# EAGLE schematic IotaWatt4.1 (EAGLE 8.1.1)
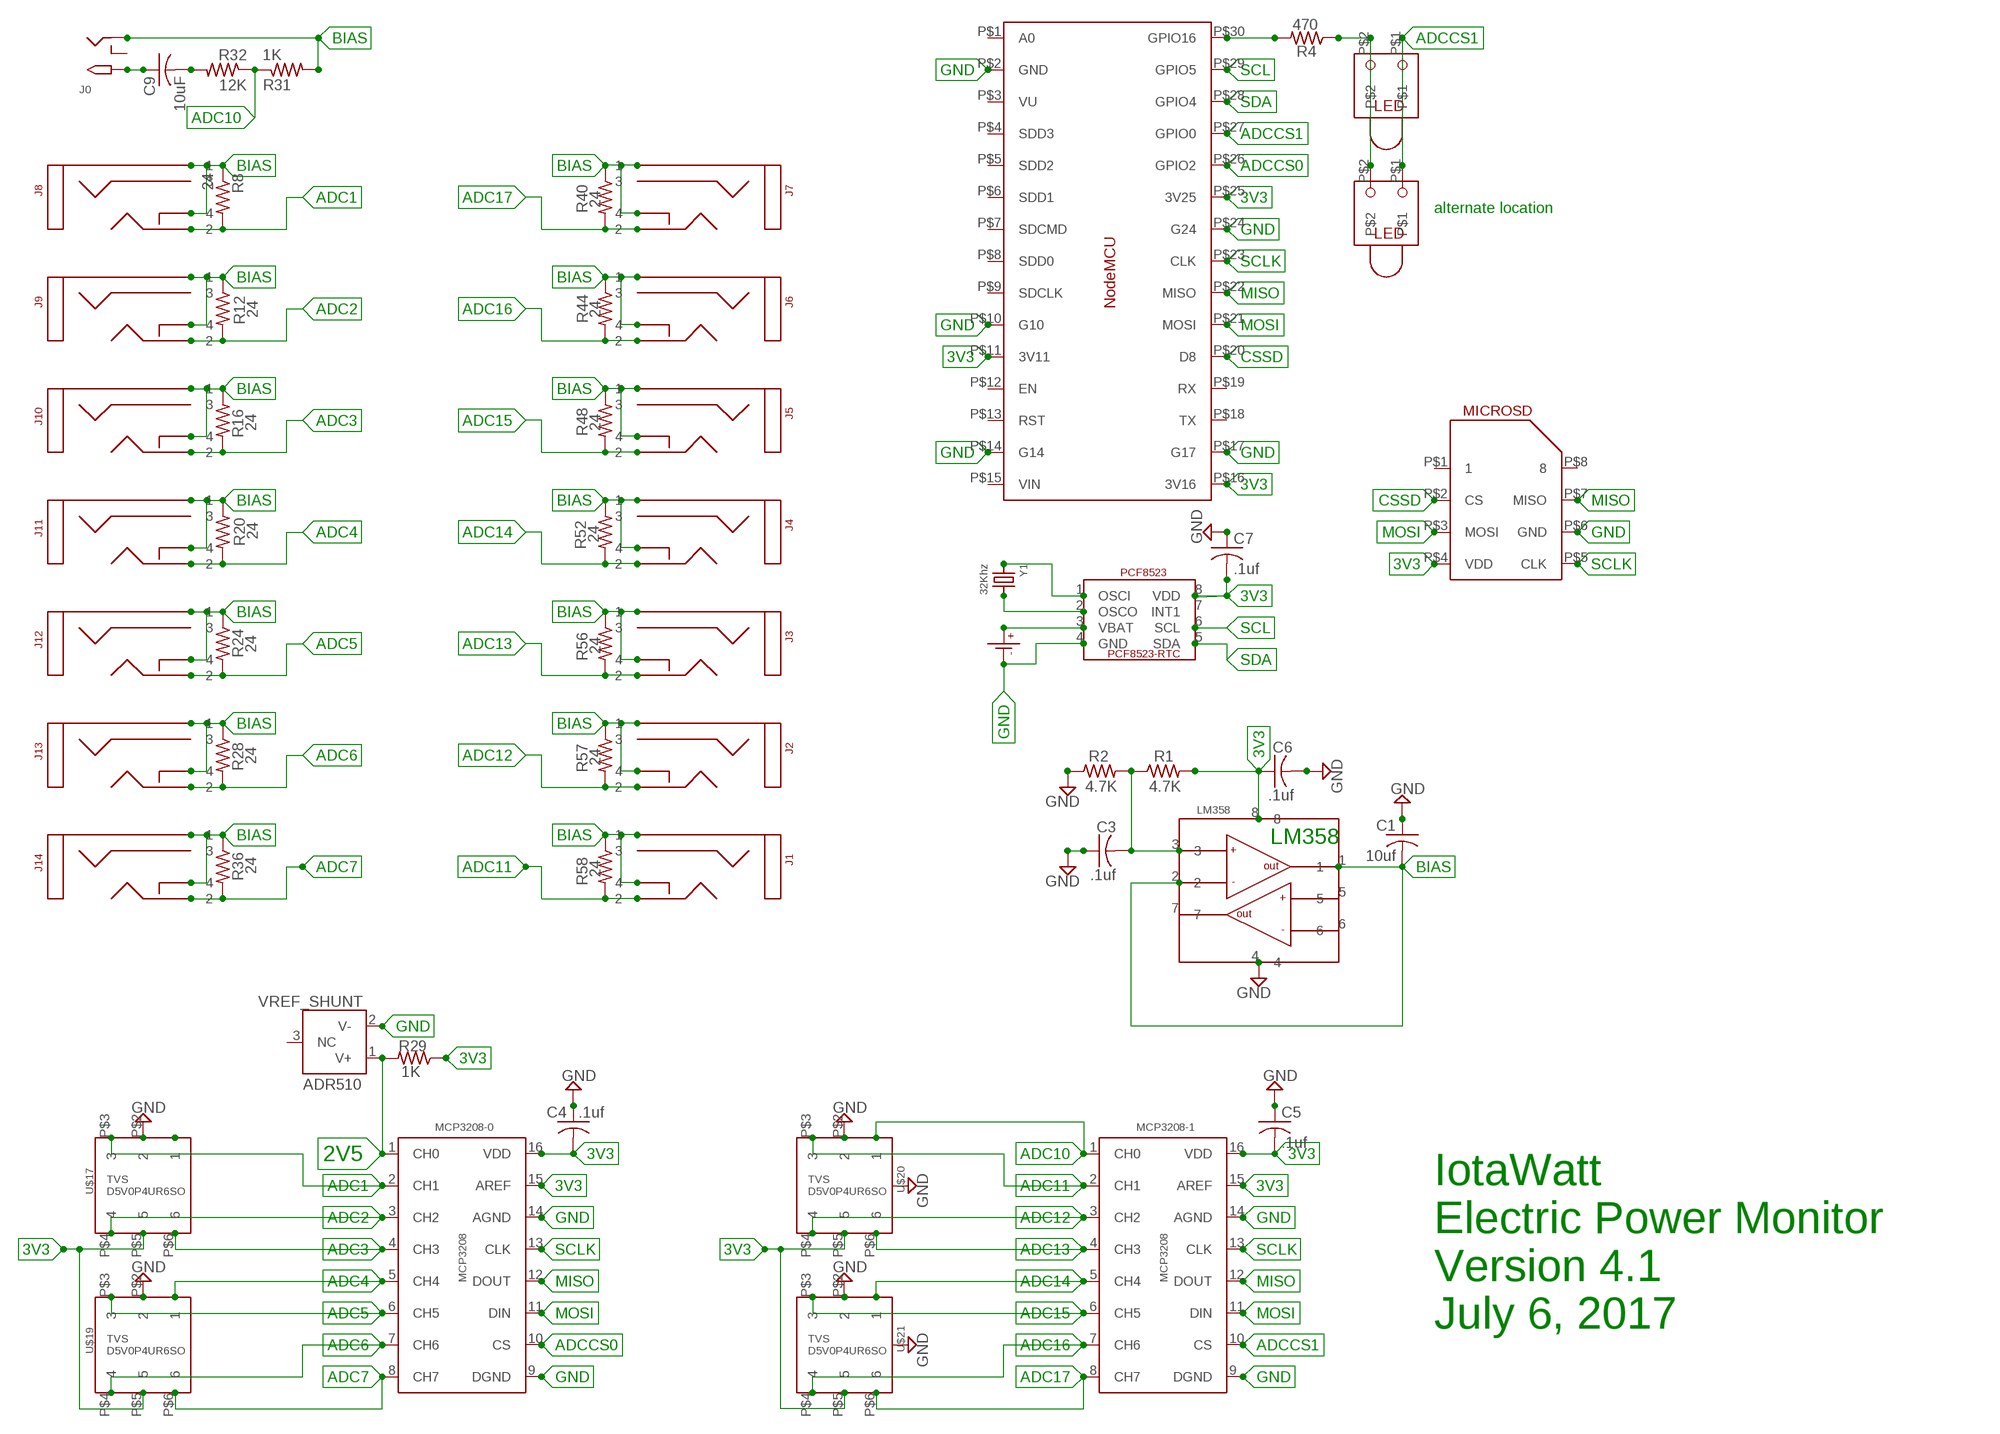
[diagram p0: schematic, sheet 1]

## Parts
ADR510  VREF_SHUNT  [SOT23_3]
C1  10uf  C-USC0805  [C0805]
C3  .1uf  C-USC0805  [C0805]
C4  .1uf  C-USC0402  [C0402]
C5  .1uf  C-USC0402  [C0402]
C6  .1uf  C-USC0402  [C0402]
C7  .1uf  C-USC0402  [C0402]
C9  10uF  C-USC0805  [C0805]
J0  2.1MMJACKSMT  [DCJACK_2MM_SMT]
J1  STEREO_SMD  [STEREO_SMT]
J2  STEREO_SMD  [STEREO_SMT]
J3  STEREO_SMD  [STEREO_SMT]
J4  STEREO_SMD  [STEREO_SMT]
J5  STEREO_SMD  [STEREO_SMT]
J6  STEREO_SMD  [STEREO_SMT]
J7  STEREO_SMD  [STEREO_SMT]
J8  STEREO_SMD  [STEREO_SMT]
J9  STEREO_SMD  [STEREO_SMT]
J10  STEREO_SMD  [STEREO_SMT]
J11  STEREO_SMD  [STEREO_SMT]
J12  STEREO_SMD  [STEREO_SMT]
J13  STEREO_SMD  [STEREO_SMT]
J14  STEREO_SMD  [STEREO_SMT]
MCP3208-0  MCP3208  [SOIC_16]
MCP3208-1  MCP3208  [SOIC_16]
MICROSD  MICROSD_PUSH/PULL  [MICROSD]
PCF8523  PCF8523_RTC  [SOIC_8]
R1  4.7K  R-US_R0805  [R0805]
R2  4.7K  R-US_R0805  [R0805]
R4  470  R-US_R0805  [R0805]
R8  24  R-US_R0805  [R0805]
R12  24  R-US_R0805  [R0805]
R16  24  R-US_R0805  [R0805]
R20  24  R-US_R0805  [R0805]
R24  24  R-US_R0805  [R0805]
R28  24  R-US_R0805  [R0805]
R29  1K  R-US_R0805  [R0805]
R31  1K  R-US_R0805  [R0805]
R32  12K  R-US_R0805  [R0805]
R36  24  R-US_R0805  [R0805]
R40  24  R-US_R0805  [R0805]
R44  24  R-US_R0805  [R0805]
R48  24  R-US_R0805  [R0805]
R52  24  R-US_R0805  [R0805]
R56  24  R-US_R0805  [R0805]
R57  24  R-US_R0805  [R0805]
R58  24  R-US_R0805  [R0805]
U$15  LED_RT_TRH  [LED_TH_RT]
U$16  NODEMCU  [NODEMCU]
U$17  TVS_4CHAN_ARRAY  [SC-74]
U$18  CR1220SMD  [CR1220SMD]
U$19  TVS_4CHAN_ARRAY  [SC-74]
U$20  TVS_4CHAN_ARRAY  [SC-74]
U$21  TVS_4CHAN_ARRAY  [SC-74]
U$22  LM358_DUAL_OP-AMP  [SOIC_8]
U$23  LED_RT_TRH  [LED_TH_RT]
Y1  32Khz  CRYSTAL8X3.8SMT  [CRYSTAL_8X3.8]

## Nets
2V5: ADR510.1(V+) MCP3208-0.1(CH0) R29.2
3V3: C4.2 C5.2 C6.1 C7.2 MCP3208-0.15(AREF) MCP3208-0.16(VDD) MCP3208-1.15(AREF) MCP3208-1.16(VDD) MICROSD.P$4(VDD) PCF8523.8(VDD) R1.2 R29.1 U$16.P$11(3V11) U$16.P$16(3V16) U$16.P$25(3V25) U$17.P$5 U$19.P$5 U$20.P$5 U$21.P$5 U$22.8
ADC1: J8.P$2 MCP3208-0.2(CH1) R8.2 U$17.P$3
ADC2: J9.P$2 MCP3208-0.3(CH2) R12.2 U$17.P$4
ADC3: J10.P$2 MCP3208-0.4(CH3) R16.2 U$17.P$6
ADC4: J11.P$2 MCP3208-0.5(CH4) R20.2 U$19.P$1
ADC5: J12.P$2 MCP3208-0.6(CH5) R24.2 U$19.P$3
ADC6: J13.P$2 MCP3208-0.7(CH6) R28.2 U$19.P$4
ADC7: J14.P$2 MCP3208-0.8(CH7) R36.2 U$19.P$6
ADC10: MCP3208-1.1(CH0) R31.1 R32.1 U$20.P$1
ADC11: J1.P$2 MCP3208-1.2(CH1) R58.2 U$20.P$3
ADC12: J2.P$2 MCP3208-1.3(CH2) R57.2 U$20.P$4
ADC13: J3.P$2 MCP3208-1.4(CH3) R56.2 U$20.P$6
ADC14: J4.P$2 MCP3208-1.5(CH4) R52.2 U$21.P$1
ADC15: J5.P$2 MCP3208-1.6(CH5) R48.2 U$21.P$3
ADC16: J6.P$2 MCP3208-1.7(CH6) R44.2 U$21.P$4
ADC17: J7.P$2 MCP3208-1.8(CH7) R40.2 U$21.P$6
ADCCS0: MCP3208-0.10(CS) U$16.P$26(GPIO2)
ADCCS1: MCP3208-1.10(CS) U$15.P$1 U$16.P$27(GPIO0) U$23.P$1
BIAS: C1.2 J0.GND(RING) J1.P$1 J1.P$4 J2.P$1 J2.P$4 J3.P$1 J3.P$4 J4.P$1 J4.P$4 J5.P$1 J5.P$4 J6.P$1 J6.P$4 J7.P$1 J7.P$4 J8.P$1 J8.P$4 J9.P$1 J9.P$4 J10.P$1 J10.P$4 J11.P$1 J11.P$4 J12.P$1 J12.P$4 J13.P$1 J13.P$4 J14.P$1 J14.P$4 R8.1 R12.1 R16.1 R20.1 R24.1 R28.1 R31.2 R36.1 R40.1 R44.1 R48.1 R52.1 R56.1 R57.1 R58.1 U$22.1 U$22.2
CSSD: MICROSD.P$2(CS) U$16.P$20(D8)
GND: ADR510.2(V-) C1.1 C3.1 C4.1 C5.1 C6.2 C7.1 MCP3208-0.9(DGND) MCP3208-0.14(AGND) MCP3208-1.9(DGND) MCP3208-1.14(AGND) MICROSD.P$6(GND) PCF8523.4(GND) R2.1 U$16.P$2(GND) U$16.P$10(G10) U$16.P$14(G14) U$16.P$17(G17) U$16.P$24(G24) U$17.P$2 U$18.P-(P$-) U$19.P$2 U$20.P$2 U$21.P$2 U$22.4
MISO: MCP3208-0.12(DOUT) MCP3208-1.12(DOUT) MICROSD.P$7(MISO) U$16.P$22(MISO)
MOSI: MCP3208-0.11(DIN) MCP3208-1.11(DIN) MICROSD.P$3(MOSI) U$16.P$21(MOSI)
N$2: C3.2 R1.1 R2.2 U$22.3
N$8: R4.1 U$15.P$2 U$23.P$2
N$10: R4.2 U$16.P$30(GPIO16)
N$16: U$17.P$1
N$17: C9.2 R32.2
N$27: C9.1 J0.PWR2(TIP)
N$43: PCF8523.3(VBAT) U$18.P+(P$+)
N$44: PCF8523.2(OSCO) Y1.P$4
N$45: PCF8523.1(OSCI) Y1.P$1
SCL: PCF8523.6(SCL) U$16.P$29(GPIO5)
SCLK: MCP3208-0.13(CLK) MCP3208-1.13(CLK) MICROSD.P$5(CLK) U$16.P$23(CLK)
SDA: PCF8523.5(SDA) U$16.P$28(GPIO4)
Unconnected: ADR510.3(NC) J0.GNDBREAK(RING_SW) J1.P$3 J2.P$3 J3.P$3 J4.P$3 J5.P$3 J6.P$3 J7.P$3 J8.P$3 J9.P$3 J10.P$3 J11.P$3 J12.P$3 J13.P$3 J14.P$3 MICROSD.P$1 MICROSD.P$8 PCF8523.7(INT1) U$16.P$1(A0) U$16.P$3(VU) U$16.P$4(SDD3) U$16.P$5(SDD2) U$16.P$6(SDD1) U$16.P$7(SDCMD) U$16.P$8(SDD0) U$16.P$9(SDCLK) U$16.P$12(EN) U$16.P$13(RST) U$16.P$15(VIN) U$16.P$18(TX) U$16.P$19(RX) U$22.5 U$22.6 U$22.7

## Notes on the sheet
- alternate location
- LM358
- IotaWatt
  Electric Power Monitor
  Version 4.1
  July 6, 2017

## Library data of the parts
ADR510 = IotaWatt_parts:VREF_SHUNT: Voltage Reference Shunt - SOT23-3 (ADR504, etc.)
C1 C3-C7 C9 = adafruit:C-US: CAPACITOR, American symbol
J0 = IotaWatt_parts:2.1MMJACK: 2.1mm x 5.5mm THM DC jack with internal switch. Digikey part #PJ-102A, 4UCON part #05537 2.1mm x 5.5mm SMT DC jack with internal switch. Digikey part #PJ-002A-SMT, 4UCON part #03267 By microbuilder.eu & adafruit.com
J1-J14 = IotaWatt_parts:STEREO_SMD: 3.5mm Stereo Jack SMT
MCP3208-0 MCP3208-1 = IotaWatt_parts:MCP3208: MCP3208 12bit SPI ADC
MICROSD = IotaWatt_parts:MICROSD_PUSH/PULL: McroSD Amphenol push/pull
PCF8523 = IotaWatt_parts:PCF8523_RTC: PCF8523-RTC SOIC-8
R1 R2 R4 R8 R12 R16 R20 R24 R28 R29 R31 R32 R36 R40 R44 R48 R52 R56-R58 = adafruit:R-US_: RESISTOR, American symbol
U$15 U$23 = IotaWatt_parts:LED_RT_TRH: LED RT ThruHole BiColor Digikey 67-2237-ND
U$16 = IotaWatt_parts:NODEMCU: NodeMCU 1.0 ESP8266
U$17 U$19-U$21 = IotaWatt_parts:TVS_4CHAN_ARRAY: TVS 4 channel array
U$18 = IotaWatt_parts:CR1220SMD: CR1220 Battery SMD
U$22 = IotaWatt_parts:LM358_DUAL_OP-AMP: LM358 Dual Op-Amp - SOIC8
Y1 = microbuilder:CRYSTAL: Crystals HC49UP - Surface Mount Crystal 4.0MHz 18pF +/-30ppm Surface Mount Crystal [Digikey: 535-9857-1-ND] 12.0 MHz Surface Mount Crystal [Digikey: 535-9869-6-ND] 25.0 MHz Surface Mount Crystal [Digikey: 535-9078-1-ND] 2.5 x 2.0mm - MEMs SMT Crystal 16.0 MHz 10pF 20ppm 2.5 x 2.0mm Crystal [Digikey -40-85°C: 535-10923-1-ND] 3.2 x 2.5mm - MEMs SMT Crystal 12.0 MHz 8pF 15ppm 3.2 x 2.5mm Crystal [Digikey: -10-70°C: 644-1047-1-ND -40-125°C: 644-1128-1-ND] 16.0 MHz 8pF 15ppm 3.2 x 2.5mm Crystal [Digikey: -10-70°C: 644-1049-1-ND -40-125°C: 644-1129-2-ND] 16.0 MHz 10pF 10ppm 3.2 x 2.5mm Crystal [Digikey: 644-1100-1-ND] 27.12 MHz 18pF 30ppm 3.2 x 2.5mm Crystal [Digikey: 887-1424-1-ND] 27.12MHz 10pF 10ppm 3.2 x 2.5mm Crystal [Digikey: 887-1329-1-ND] 4.9 x 1.8mm - MEMs SMT Crystal 32.768 KHz 12.5pF 20ppm 4.9 x 1.8mm Crystal [Digikey: SE2415CT-ND] 8.0 x 3.8mm - Surface Mount Crystal 32.768kHz 12.5pF 20ppm -40°C-85°C [Digikey: 535-9166-2-ND] Cylinder 32.768KHz Cylinder Crystal (2x6mm body) [Ex. Digikey: 300-8341-2-ND]